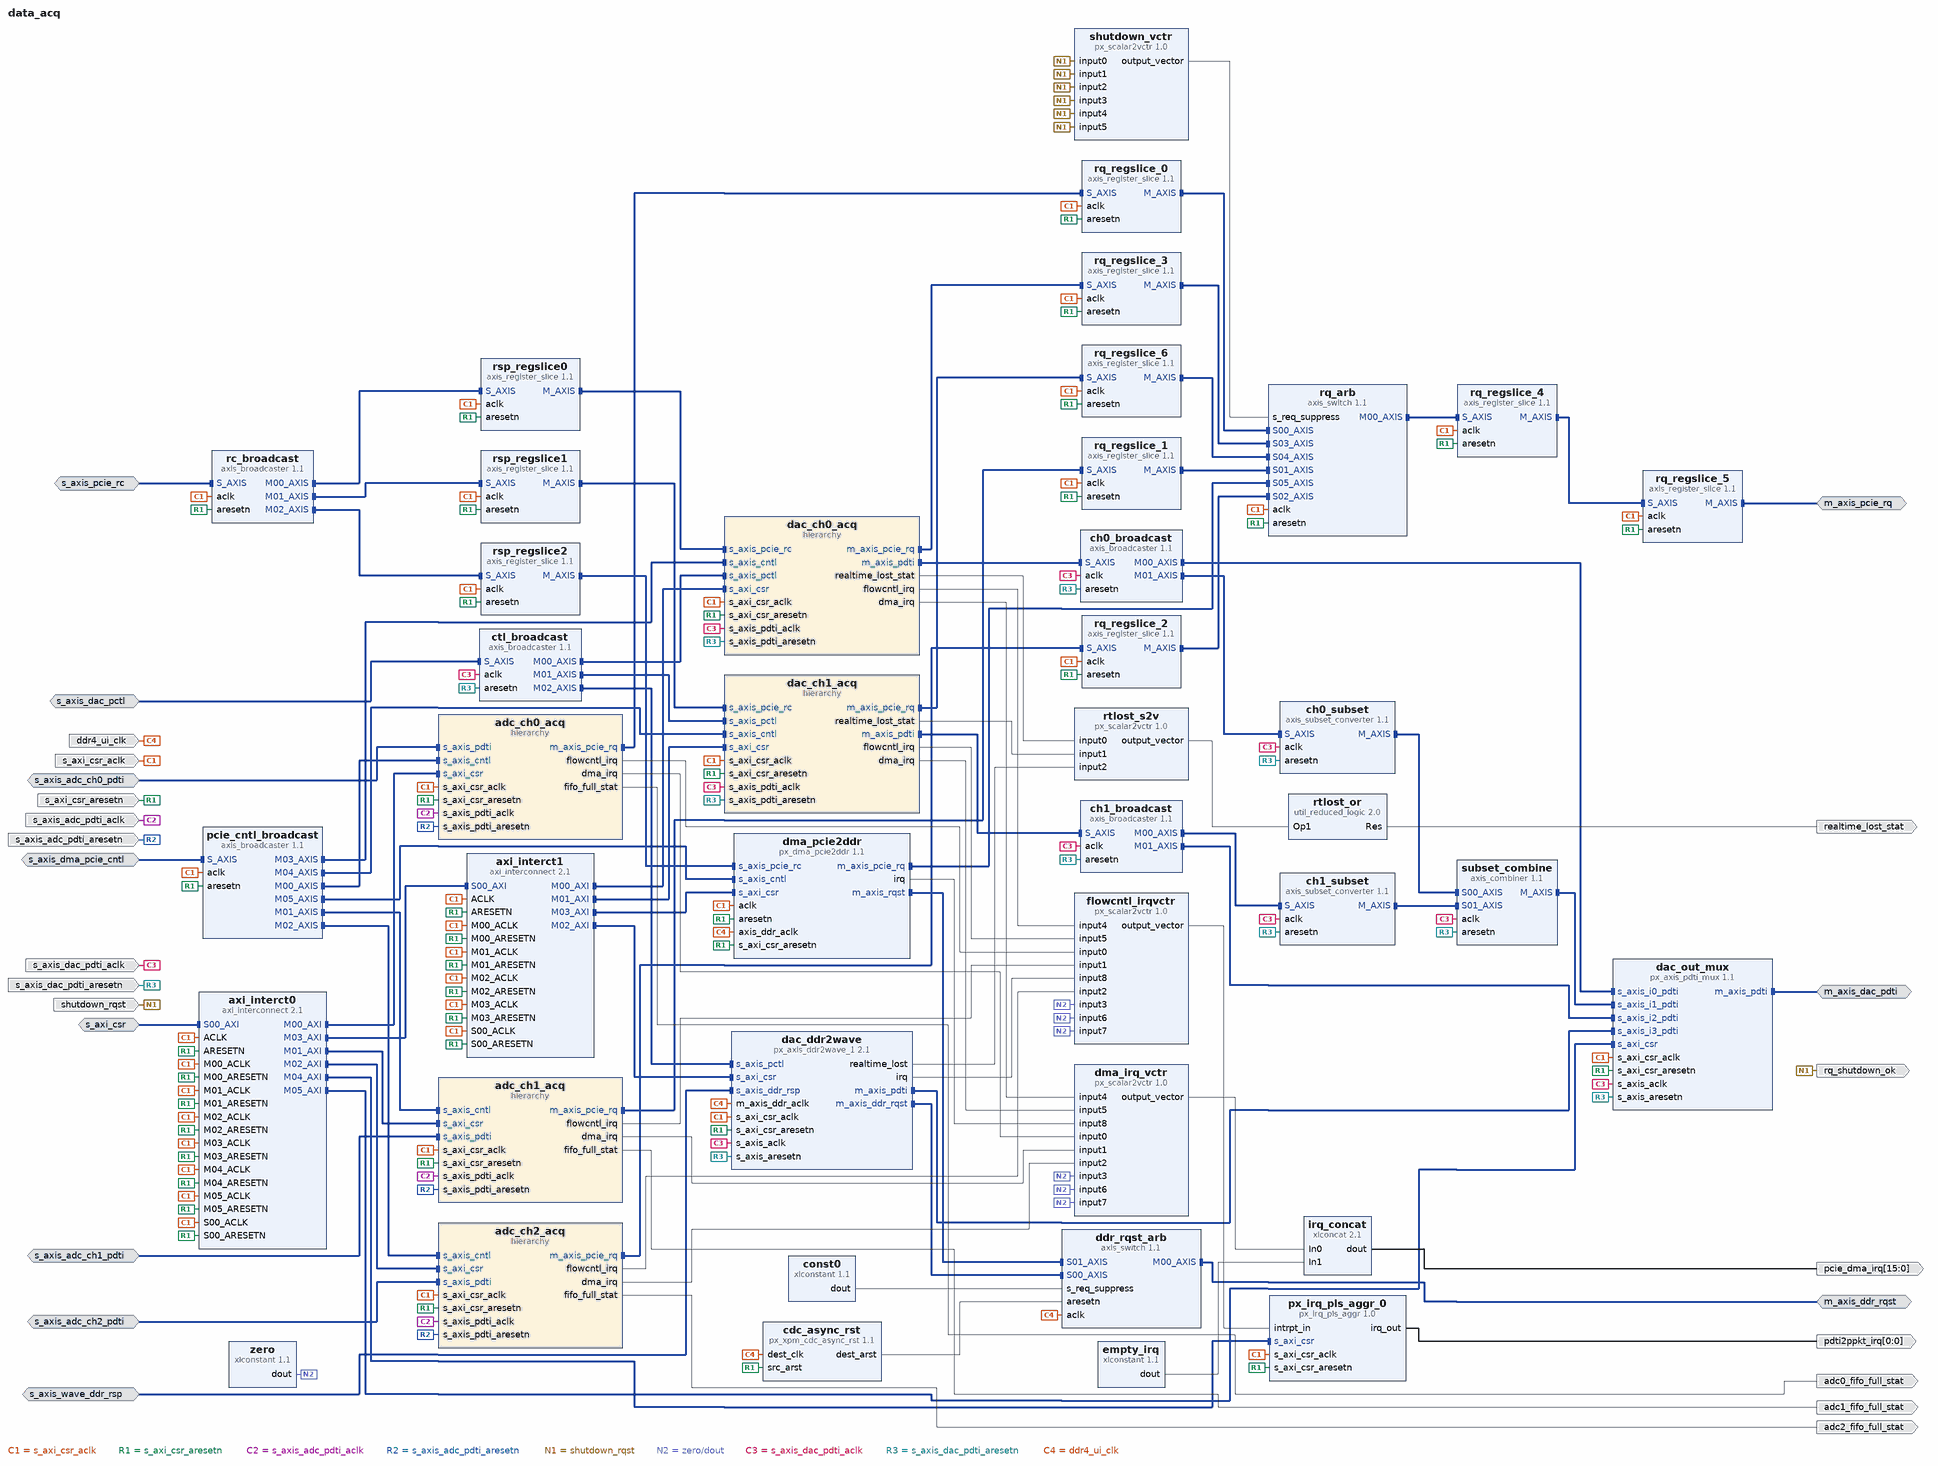
[diagram p0: block diagram of the top level]
# Vivado block design data_acq, xcku060-ffva1156-2-e, Vivado 2019.2
create_bd_design data_acq

create_bd_intf_port -mode Slave -vlnv xilinx.com:interface:aximm_rtl:1.0 s_axi_csr
set_property -dict [list \
  CONFIG.DATA_WIDTH 32 \
  CONFIG.PROTOCOL AXI4LITE \
  CONFIG.ID_WIDTH 0 \
  CONFIG.ADDR_WIDTH 26 \
  CONFIG.AWUSER_WIDTH 0 \
  CONFIG.ARUSER_WIDTH 0 \
  CONFIG.WUSER_WIDTH 0 \
  CONFIG.RUSER_WIDTH 0 \
  CONFIG.BUSER_WIDTH 0 \
  CONFIG.READ_WRITE_MODE READ_WRITE \
  CONFIG.HAS_BURST 1 \
  CONFIG.HAS_LOCK 1 \
  CONFIG.HAS_PROT 1 \
  CONFIG.HAS_CACHE 1 \
  CONFIG.HAS_QOS 1 \
  CONFIG.HAS_REGION 1 \
  CONFIG.HAS_WSTRB 1 \
  CONFIG.HAS_BRESP 1 \
  CONFIG.HAS_RRESP 1 \
  CONFIG.SUPPORTS_NARROW_BURST 0 \
  CONFIG.NUM_READ_OUTSTANDING 1 \
  CONFIG.NUM_WRITE_OUTSTANDING 1 \
  CONFIG.MAX_BURST_LENGTH 1 \
  CONFIG.NUM_READ_THREADS 1 \
  CONFIG.NUM_WRITE_THREADS 1 \
  CONFIG.RUSER_BITS_PER_BYTE 0 \
  CONFIG.WUSER_BITS_PER_BYTE 0 \
] [get_bd_intf_ports s_axi_csr]
create_bd_intf_port -mode Slave -vlnv xilinx.com:interface:axis_rtl:1.0 s_axis_adc_ch0_pdti
set_property -dict [list \
  CONFIG.TDATA_NUM_BYTES 4 \
  CONFIG.TDEST_WIDTH 0 \
  CONFIG.TID_WIDTH 0 \
  CONFIG.TUSER_WIDTH 128 \
  CONFIG.HAS_TREADY 0 \
  CONFIG.HAS_TSTRB 0 \
  CONFIG.HAS_TKEEP 0 \
  CONFIG.HAS_TLAST 0 \
  CONFIG.LAYERED_METADATA undef \
] [get_bd_intf_ports s_axis_adc_ch0_pdti]
create_bd_intf_port -mode Slave -vlnv xilinx.com:interface:axis_rtl:1.0 s_axis_adc_ch1_pdti
set_property -dict [list \
  CONFIG.TDATA_NUM_BYTES 4 \
  CONFIG.TDEST_WIDTH 0 \
  CONFIG.TID_WIDTH 0 \
  CONFIG.TUSER_WIDTH 128 \
  CONFIG.HAS_TREADY 0 \
  CONFIG.HAS_TSTRB 0 \
  CONFIG.HAS_TKEEP 0 \
  CONFIG.HAS_TLAST 0 \
  CONFIG.LAYERED_METADATA undef \
] [get_bd_intf_ports s_axis_adc_ch1_pdti]
create_bd_intf_port -mode Slave -vlnv xilinx.com:interface:axis_rtl:1.0 s_axis_adc_ch2_pdti
set_property -dict [list \
  CONFIG.TDATA_NUM_BYTES 4 \
  CONFIG.TDEST_WIDTH 0 \
  CONFIG.TID_WIDTH 0 \
  CONFIG.TUSER_WIDTH 128 \
  CONFIG.HAS_TREADY 0 \
  CONFIG.HAS_TSTRB 0 \
  CONFIG.HAS_TKEEP 0 \
  CONFIG.HAS_TLAST 0 \
  CONFIG.LAYERED_METADATA undef \
] [get_bd_intf_ports s_axis_adc_ch2_pdti]
create_bd_intf_port -mode Slave -vlnv xilinx.com:interface:axis_rtl:1.0 s_axis_dac_pctl
set_property -dict [list \
  CONFIG.TDATA_NUM_BYTES 1 \
  CONFIG.TDEST_WIDTH 0 \
  CONFIG.TID_WIDTH 0 \
  CONFIG.TUSER_WIDTH 0 \
  CONFIG.HAS_TREADY 0 \
  CONFIG.HAS_TSTRB 0 \
  CONFIG.HAS_TKEEP 0 \
  CONFIG.HAS_TLAST 0 \
  CONFIG.LAYERED_METADATA undef \
] [get_bd_intf_ports s_axis_dac_pctl]
create_bd_intf_port -mode Slave -vlnv xilinx.com:interface:axis_rtl:1.0 s_axis_dma_pcie_cntl
set_property -dict [list \
  CONFIG.TDATA_NUM_BYTES 1 \
  CONFIG.TDEST_WIDTH 0 \
  CONFIG.TID_WIDTH 0 \
  CONFIG.TUSER_WIDTH 0 \
  CONFIG.HAS_TREADY 1 \
  CONFIG.HAS_TSTRB 0 \
  CONFIG.HAS_TKEEP 0 \
  CONFIG.HAS_TLAST 0 \
  CONFIG.LAYERED_METADATA undef \
] [get_bd_intf_ports s_axis_dma_pcie_cntl]
create_bd_intf_port -mode Master -vlnv xilinx.com:interface:axis_rtl:1.0 m_axis_pcie_rq
set_property -dict {CONFIG.FREQ_HZ 250000000} [get_bd_intf_ports m_axis_pcie_rq]
create_bd_intf_port -mode Slave -vlnv xilinx.com:interface:axis_rtl:1.0 s_axis_pcie_rc
set_property -dict [list \
  CONFIG.TDATA_NUM_BYTES 32 \
  CONFIG.TDEST_WIDTH 0 \
  CONFIG.TID_WIDTH 0 \
  CONFIG.TUSER_WIDTH 75 \
  CONFIG.HAS_TREADY 1 \
  CONFIG.HAS_TSTRB 0 \
  CONFIG.HAS_TKEEP 1 \
  CONFIG.HAS_TLAST 1 \
  CONFIG.LAYERED_METADATA undef \
] [get_bd_intf_ports s_axis_pcie_rc]
create_bd_intf_port -mode Master -vlnv xilinx.com:interface:axis_rtl:1.0 m_axis_ddr_rqst
set_property -dict {CONFIG.FREQ_HZ 300000000} [get_bd_intf_ports m_axis_ddr_rqst]
create_bd_intf_port -mode Slave -vlnv xilinx.com:interface:axis_rtl:1.0 s_axis_wave_ddr_rsp
set_property -dict [list \
  CONFIG.TDATA_NUM_BYTES 64 \
  CONFIG.TDEST_WIDTH 0 \
  CONFIG.TID_WIDTH 8 \
  CONFIG.TUSER_WIDTH 256 \
  CONFIG.HAS_TREADY 0 \
  CONFIG.HAS_TSTRB 0 \
  CONFIG.HAS_TKEEP 0 \
  CONFIG.HAS_TLAST 1 \
  CONFIG.LAYERED_METADATA undef \
] [get_bd_intf_ports s_axis_wave_ddr_rsp]
create_bd_intf_port -mode Master -vlnv xilinx.com:interface:axis_rtl:1.0 m_axis_dac_pdti
set_property -dict {CONFIG.FREQ_HZ 250000000 CONFIG.CLK_DOMAIN data_acq_s_axis_dac_pdti_aclk} [get_bd_intf_ports m_axis_dac_pdti]
create_bd_port -dir I -type clk s_axi_csr_aclk
set_property -dict [list \
  CONFIG.ASSOCIATED_BUSIF s_axi_csr:s_axis_dma_pcie_cntl:m_axis_pcie_rq:s_axis_pcie_rc \
  CONFIG.FREQ_HZ 250000000 \
] [get_bd_ports s_axi_csr_aclk]
create_bd_port -dir I -type rst s_axi_csr_aresetn
create_bd_port -dir I -type clk s_axis_adc_pdti_aclk
set_property -dict [list \
  CONFIG.ASSOCIATED_BUSIF s_axis_adc_ch0_pdti:s_axis_adc_ch1_pdti:s_axis_adc_ch2_pdti \
  CONFIG.ASSOCIATED_RESET s_axis_adc_pdti_aresetn \
  CONFIG.FREQ_HZ 200000000 \
] [get_bd_ports s_axis_adc_pdti_aclk]
create_bd_port -dir I -type rst s_axis_adc_pdti_aresetn
create_bd_port -dir I shutdown_rqst
create_bd_port -dir O rq_shutdown_ok
create_bd_port -dir O -from 15 -to 0 pcie_dma_irq
create_bd_port -dir O adc0_fifo_full_stat
create_bd_port -dir O -from 0 -to 0 pdti2ppkt_irq
create_bd_port -dir O realtime_lost_stat
create_bd_port -dir I -type clk s_axis_dac_pdti_aclk
set_property -dict [list \
  CONFIG.ASSOCIATED_BUSIF s_axis_dac_pctl:m_axis_dac_pdti:s_axis_dac_pctl \
  CONFIG.ASSOCIATED_RESET s_axis_dac_pdti_aresetn \
  CONFIG.CLK_DOMAIN data_acq_s_axis_dac_pdti_aclk \
  CONFIG.FREQ_HZ 250000000 \
] [get_bd_ports s_axis_dac_pdti_aclk]
create_bd_port -dir I -type rst s_axis_dac_pdti_aresetn
create_bd_port -dir O adc1_fifo_full_stat
create_bd_port -dir O adc2_fifo_full_stat
create_bd_port -dir I -type clk ddr4_ui_clk
set_property -dict {CONFIG.ASSOCIATED_RESET s_axi_csr_aresetn CONFIG.FREQ_HZ 300000000} [get_bd_ports ddr4_ui_clk]

create_bd_cell -type hier adc_ch0_acq
create_bd_cell -type hier dac_ch1_acq
create_bd_cell -type hier dac_ch0_acq
create_bd_cell -type hier adc_ch1_acq
create_bd_cell -type hier adc_ch2_acq
create_bd_cell -type ip -vlnv xilinx.com:ip:util_reduced_logic:2.0 rtlost_or
set_property -dict {CONFIG.C_OPERATION or CONFIG.C_SIZE 3} [get_bd_cells rtlost_or]
create_bd_cell -type ip -vlnv xilinx.com:ip:xlconcat:2.1 irq_concat
set_property -dict {CONFIG.IN0_WIDTH 9 CONFIG.IN1_WIDTH 7 CONFIG.dout_width 16} [get_bd_cells irq_concat]
create_bd_cell -type ip -vlnv xilinx.com:ip:axi_interconnect:2.1 axi_interct0
set_property -dict [list \
  CONFIG.M00_HAS_REGSLICE 3 \
  CONFIG.M01_HAS_REGSLICE 3 \
  CONFIG.M02_HAS_REGSLICE 3 \
  CONFIG.M03_HAS_REGSLICE 3 \
  CONFIG.M04_HAS_REGSLICE 3 \
  CONFIG.M05_HAS_REGSLICE 3 \
  CONFIG.M06_HAS_REGSLICE 3 \
  CONFIG.M07_HAS_REGSLICE 3 \
  CONFIG.NUM_MI 6 \
  CONFIG.S00_HAS_REGSLICE 1 \
  CONFIG.SYNCHRONIZATION_STAGES 2 \
] [get_bd_cells axi_interct0]
create_bd_cell -type ip -vlnv xilinx.com:ip:axi_interconnect:2.1 axi_interct1
set_property -dict [list \
  CONFIG.M00_HAS_REGSLICE 3 \
  CONFIG.M01_HAS_REGSLICE 3 \
  CONFIG.M02_HAS_REGSLICE 3 \
  CONFIG.M03_HAS_REGSLICE 3 \
  CONFIG.M04_HAS_REGSLICE 3 \
  CONFIG.M05_HAS_REGSLICE 3 \
  CONFIG.M06_HAS_REGSLICE 3 \
  CONFIG.M07_HAS_REGSLICE 3 \
  CONFIG.NUM_MI 4 \
  CONFIG.S00_HAS_REGSLICE 1 \
  CONFIG.SYNCHRONIZATION_STAGES 2 \
] [get_bd_cells axi_interct1]
create_bd_cell -type ip -vlnv xilinx.com:ip:axis_broadcaster:1.1 pcie_cntl_broadcast
set_property -dict [list \
  CONFIG.HAS_TREADY 0 \
  CONFIG.M02_TDATA_REMAP {tdata[7:0]} \
  CONFIG.M03_TDATA_REMAP {tdata[7:0]} \
  CONFIG.M04_TDATA_REMAP {tdata[7:0]} \
  CONFIG.M05_TDATA_REMAP {tdata[7:0]} \
  CONFIG.NUM_MI 6 \
] [get_bd_cells pcie_cntl_broadcast]
create_bd_cell -type ip -vlnv xilinx.com:ip:axis_broadcaster:1.1 ctl_broadcast
set_property -dict {CONFIG.HAS_TREADY 0 CONFIG.M02_TDATA_REMAP {tdata[7:0]} CONFIG.NUM_MI 3} [get_bd_cells ctl_broadcast]
create_bd_cell -type ip -vlnv xilinx.com:ip:axis_broadcaster:1.1 ch0_broadcast
set_property -dict [list \
  CONFIG.M00_TDATA_REMAP {tdata[31:0]} \
  CONFIG.M00_TUSER_REMAP {tuser[127:0]} \
  CONFIG.M01_TDATA_REMAP {tdata[31:0]} \
  CONFIG.M01_TUSER_REMAP {tuser[127:0]} \
] [get_bd_cells ch0_broadcast]
create_bd_cell -type ip -vlnv xilinx.com:ip:axis_combiner:1.1 subset_combine
create_bd_cell -type ip -vlnv xilinx.com:ip:axis_register_slice:1.1 rq_regslice_0
create_bd_cell -type ip -vlnv xilinx.com:ip:axis_subset_converter:1.1 ch0_subset
set_property -dict [list \
  CONFIG.M_TDATA_NUM_BYTES 2 \
  CONFIG.M_TUSER_WIDTH 64 \
  CONFIG.S_TDATA_NUM_BYTES 4 \
  CONFIG.S_TUSER_WIDTH 128 \
  CONFIG.TDATA_REMAP {tdata[15:0]} \
  CONFIG.TUSER_REMAP {tuser[63:0]} \
] [get_bd_cells ch0_subset]
create_bd_cell -type ip -vlnv xilinx.com:ip:axis_subset_converter:1.1 ch1_subset
set_property -dict [list \
  CONFIG.M_TDATA_NUM_BYTES 2 \
  CONFIG.M_TUSER_WIDTH 64 \
  CONFIG.S_TDATA_NUM_BYTES 4 \
  CONFIG.S_TUSER_WIDTH 128 \
  CONFIG.TDATA_REMAP {tdata[15:0]} \
  CONFIG.TUSER_REMAP {tuser[127:64]} \
] [get_bd_cells ch1_subset]
create_bd_cell -type ip -vlnv xilinx.com:ip:axis_switch:1.1 rq_arb
set_property -dict [list \
  CONFIG.ARB_ALGORITHM 3 \
  CONFIG.ARB_ON_MAX_XFERS 0 \
  CONFIG.ARB_ON_TLAST 1 \
  CONFIG.HAS_TKEEP 1 \
  CONFIG.HAS_TLAST 1 \
  CONFIG.NUM_SI 6 \
  CONFIG.TDATA_NUM_BYTES 32 \
  CONFIG.TUSER_WIDTH 60 \
] [get_bd_cells rq_arb]
create_bd_cell -type ip -vlnv xilinx.com:ip:axis_broadcaster:1.1 ch1_broadcast
set_property -dict [list \
  CONFIG.M00_TDATA_REMAP {tdata[31:0]} \
  CONFIG.M00_TUSER_REMAP {tuser[127:0]} \
  CONFIG.M01_TDATA_REMAP {tdata[31:0]} \
  CONFIG.M01_TUSER_REMAP {tuser[127:0]} \
] [get_bd_cells ch1_broadcast]
create_bd_cell -type ip -vlnv xilinx.com:ip:axis_broadcaster:1.1 rc_broadcast
set_property -dict [list \
  CONFIG.M00_TDATA_REMAP {tdata[255:0]} \
  CONFIG.M00_TUSER_REMAP {tuser[74:0]} \
  CONFIG.M01_TDATA_REMAP {tdata[255:0]} \
  CONFIG.M01_TUSER_REMAP {tuser[74:0]} \
  CONFIG.M02_TDATA_REMAP {tdata[255:0]} \
  CONFIG.M02_TUSER_REMAP {tuser[74:0]} \
  CONFIG.NUM_MI 3 \
] [get_bd_cells rc_broadcast]
create_bd_cell -type ip -vlnv pentek.com:px_ip:px_axis_ddr2wave_1:2.1 dac_ddr2wave
set_property -dict {CONFIG.ddr4_requestor_id 1} [get_bd_cells dac_ddr2wave]
create_bd_cell -type ip -vlnv pentek.com:px_ip:px_axis_pdti_mux:1.1 dac_out_mux
set_property -dict {CONFIG.data_byte_width 4 CONFIG.num_input_streams 4} [get_bd_cells dac_out_mux]
create_bd_cell -type ip -vlnv pentek.com:px_ip:px_dma_pcie2ddr:1.1 dma_pcie2ddr
set_property -dict {CONFIG.pcie_channel 6} [get_bd_cells dma_pcie2ddr]
create_bd_cell -type ip -vlnv pentek.com:px_ip:px_irq_pls_aggr:1.0 px_irq_pls_aggr_0
set_property -dict {CONFIG.num_interrupt_sources 9} [get_bd_cells px_irq_pls_aggr_0]
create_bd_cell -type ip -vlnv pentek.com:px_ip:px_scalar2vctr:1.0 shutdown_vctr
set_property -dict {CONFIG.number_inputs 6} [get_bd_cells shutdown_vctr]
create_bd_cell -type ip -vlnv pentek.com:px_ip:px_scalar2vctr:1.0 flowcntl_irqvctr
set_property -dict {CONFIG.number_inputs 9} [get_bd_cells flowcntl_irqvctr]
create_bd_cell -type ip -vlnv pentek.com:px_ip:px_scalar2vctr:1.0 rtlost_s2v
set_property -dict {CONFIG.number_inputs 3} [get_bd_cells rtlost_s2v]
create_bd_cell -type ip -vlnv pentek.com:px_ip:px_scalar2vctr:1.0 dma_irq_vctr
set_property -dict {CONFIG.number_inputs 9} [get_bd_cells dma_irq_vctr]
create_bd_cell -type ip -vlnv pentek.com:px_ip:px_xpm_cdc_async_rst:1.1 cdc_async_rst
set_property -dict {CONFIG.DEST_SYNC_FF 3} [get_bd_cells cdc_async_rst]
create_bd_cell -type ip -vlnv xilinx.com:ip:axis_switch:1.1 ddr_rqst_arb
set_property -dict [list \
  CONFIG.ARB_ALGORITHM 3 \
  CONFIG.ARB_ON_MAX_XFERS 0 \
  CONFIG.ARB_ON_TLAST 1 \
  CONFIG.HAS_TLAST 1 \
  CONFIG.NUM_SI 2 \
  CONFIG.TDATA_NUM_BYTES 64 \
  CONFIG.TUSER_WIDTH 256 \
] [get_bd_cells ddr_rqst_arb]
create_bd_cell -type ip -vlnv xilinx.com:ip:axis_register_slice:1.1 rq_regslice_1
create_bd_cell -type ip -vlnv xilinx.com:ip:axis_register_slice:1.1 rq_regslice_4
create_bd_cell -type ip -vlnv xilinx.com:ip:axis_register_slice:1.1 rq_regslice_2
create_bd_cell -type ip -vlnv xilinx.com:ip:axis_register_slice:1.1 rq_regslice_3
create_bd_cell -type ip -vlnv xilinx.com:ip:axis_register_slice:1.1 rsp_regslice0
create_bd_cell -type ip -vlnv xilinx.com:ip:axis_register_slice:1.1 rq_regslice_6
create_bd_cell -type ip -vlnv xilinx.com:ip:axis_register_slice:1.1 rq_regslice_5
create_bd_cell -type ip -vlnv xilinx.com:ip:axis_register_slice:1.1 rsp_regslice1
create_bd_cell -type ip -vlnv xilinx.com:ip:axis_register_slice:1.1 rsp_regslice2
create_bd_cell -type ip -vlnv xilinx.com:ip:xlconstant:1.1 empty_irq
set_property -dict {CONFIG.CONST_VAL 0 CONFIG.CONST_WIDTH 7} [get_bd_cells empty_irq]
create_bd_cell -type ip -vlnv xilinx.com:ip:xlconstant:1.1 zero
set_property -dict {CONFIG.CONST_VAL 0} [get_bd_cells zero]
create_bd_cell -type ip -vlnv xilinx.com:ip:xlconstant:1.1 const0
set_property -dict {CONFIG.CONST_VAL 0 CONFIG.CONST_WIDTH 2} [get_bd_cells const0]

# ---- hierarchy /adc_ch0_acq ----
current_bd_instance /adc_ch0_acq
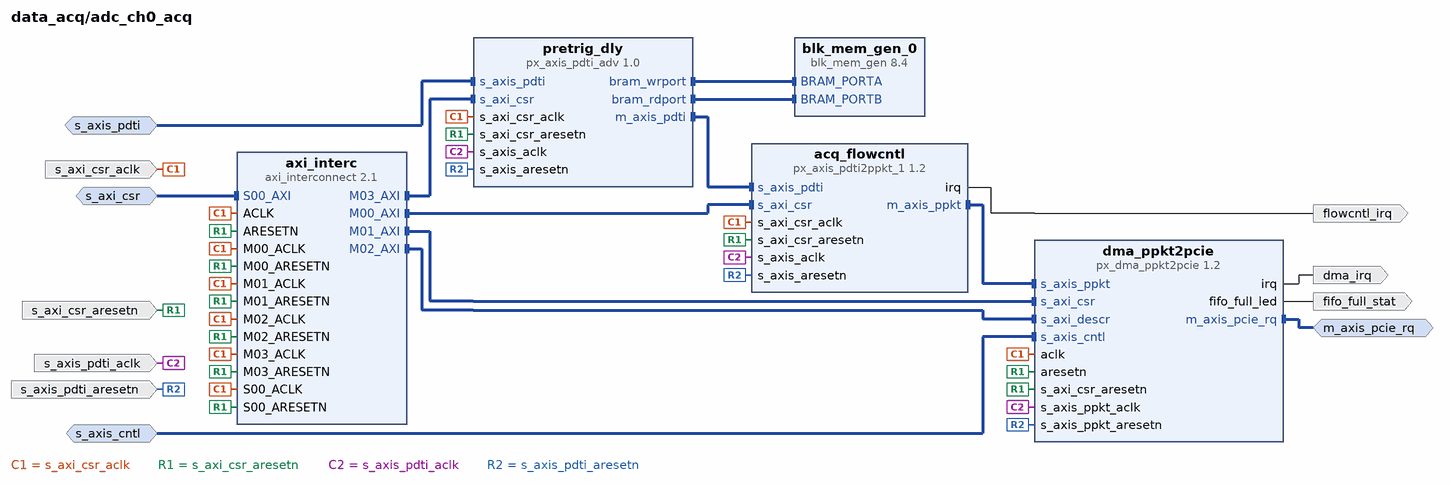
[diagram p1: block diagram inside /adc_ch0_acq]
create_bd_intf_pin -mode Slave -vlnv xilinx.com:interface:aximm_rtl:1.0 s_axi_csr
create_bd_intf_pin -mode Slave -vlnv xilinx.com:interface:axis_rtl:1.0 s_axis_pdti
create_bd_intf_pin -mode Master -vlnv xilinx.com:interface:axis_rtl:1.0 m_axis_pcie_rq
create_bd_intf_pin -mode Slave -vlnv xilinx.com:interface:axis_rtl:1.0 s_axis_cntl
create_bd_pin -dir I s_axi_csr_aclk
create_bd_pin -dir I s_axi_csr_aresetn
create_bd_pin -dir O flowcntl_irq
create_bd_pin -dir O dma_irq
create_bd_pin -dir O fifo_full_stat
create_bd_pin -dir I s_axis_pdti_aclk
create_bd_pin -dir I s_axis_pdti_aresetn

create_bd_cell -type ip -vlnv xilinx.com:ip:axi_interconnect:2.1 axi_interc
set_property -dict [list \
  CONFIG.M00_HAS_REGSLICE 3 \
  CONFIG.M01_HAS_REGSLICE 3 \
  CONFIG.M02_HAS_REGSLICE 3 \
  CONFIG.NUM_MI 4 \
  CONFIG.S00_HAS_REGSLICE 1 \
  CONFIG.SYNCHRONIZATION_STAGES 2 \
] [get_bd_cells axi_interc]
create_bd_cell -type ip -vlnv xilinx.com:ip:blk_mem_gen:8.4 blk_mem_gen_0
set_property -dict [list \
  CONFIG.Assume_Synchronous_Clk true \
  CONFIG.Byte_Size 8 \
  CONFIG.Enable_32bit_Address false \
  CONFIG.Enable_B Use_ENB_Pin \
  CONFIG.Memory_Type Simple_Dual_Port_RAM \
  CONFIG.Operating_Mode_A NO_CHANGE \
  CONFIG.Port_B_Clock 100 \
  CONFIG.Port_B_Enable_Rate 100 \
  CONFIG.Read_Width_B 160 \
  CONFIG.Register_PortB_Output_of_Memory_Primitives true \
  CONFIG.Use_Byte_Write_Enable true \
  CONFIG.Write_Depth_A 1024 \
  CONFIG.Write_Width_A 160 \
  CONFIG.Write_Width_B 160 \
  CONFIG.use_bram_block Stand_Alone \
] [get_bd_cells blk_mem_gen_0]
create_bd_cell -type ip -vlnv pentek.com:px_ip:px_axis_pdti2ppkt_1:1.2 acq_flowcntl
create_bd_cell -type ip -vlnv pentek.com:user:px_axis_pdti_adv:1.0 pretrig_dly
set_property -dict {CONFIG.data_byte_width 4 CONFIG.delay_ctl_width 10} [get_bd_cells pretrig_dly]
create_bd_cell -type ip -vlnv pentek.com:px_ip:px_dma_ppkt2pcie:1.2 dma_ppkt2pcie
set_property -dict {CONFIG.fifo_size 2 CONFIG.input_word_width 2 CONFIG.lite false} [get_bd_cells dma_ppkt2pcie]

# ---- hierarchy /dac_ch1_acq ----
current_bd_instance /dac_ch1_acq
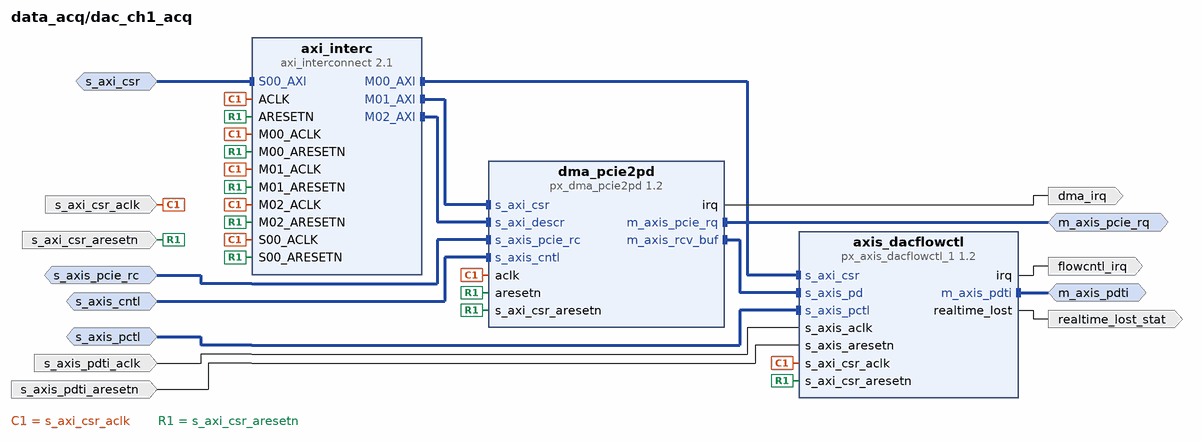
[diagram p2: block diagram inside /dac_ch1_acq]
create_bd_intf_pin -mode Slave -vlnv xilinx.com:interface:aximm_rtl:1.0 s_axi_csr
create_bd_intf_pin -mode Slave -vlnv xilinx.com:interface:axis_rtl:1.0 s_axis_pctl
create_bd_intf_pin -mode Master -vlnv xilinx.com:interface:axis_rtl:1.0 m_axis_pcie_rq
create_bd_intf_pin -mode Slave -vlnv xilinx.com:interface:axis_rtl:1.0 s_axis_cntl
create_bd_intf_pin -mode Slave -vlnv xilinx.com:interface:axis_rtl:1.0 s_axis_pcie_rc
create_bd_intf_pin -mode Master -vlnv xilinx.com:interface:axis_rtl:1.0 m_axis_pdti
create_bd_pin -dir I s_axi_csr_aclk
create_bd_pin -dir I s_axi_csr_aresetn
create_bd_pin -dir O flowcntl_irq
create_bd_pin -dir O dma_irq
create_bd_pin -dir O realtime_lost_stat
create_bd_pin -dir I s_axis_pdti_aclk
create_bd_pin -dir I s_axis_pdti_aresetn

create_bd_cell -type ip -vlnv xilinx.com:ip:axi_interconnect:2.1 axi_interc
set_property -dict [list \
  CONFIG.M00_HAS_REGSLICE 3 \
  CONFIG.M01_HAS_REGSLICE 3 \
  CONFIG.M02_HAS_REGSLICE 3 \
  CONFIG.NUM_MI 3 \
  CONFIG.S00_HAS_REGSLICE 1 \
  CONFIG.SYNCHRONIZATION_STAGES 2 \
] [get_bd_cells axi_interc]
create_bd_cell -type ip -vlnv xilinx.com:px_ip:px_axis_dacflowctl_1:1.2 axis_dacflowctl
create_bd_cell -type ip -vlnv pentek.com:px_ip:px_dma_pcie2pd:1.2 dma_pcie2pd
set_property -dict {CONFIG.pcie_channel 5} [get_bd_cells dma_pcie2pd]

# ---- hierarchy /dac_ch0_acq ----
current_bd_instance /dac_ch0_acq
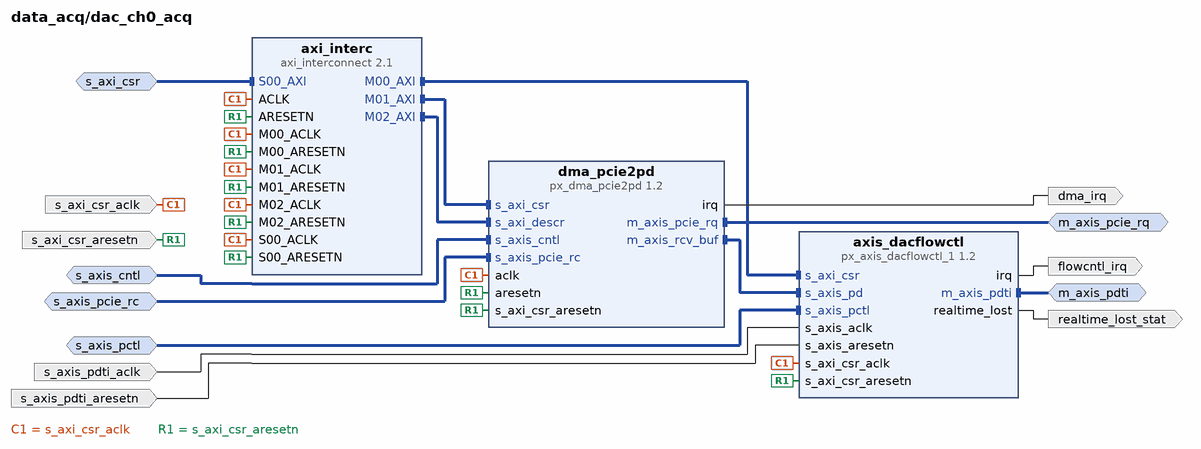
[diagram p3: block diagram inside /dac_ch0_acq]
create_bd_intf_pin -mode Slave -vlnv xilinx.com:interface:aximm_rtl:1.0 s_axi_csr
create_bd_intf_pin -mode Slave -vlnv xilinx.com:interface:axis_rtl:1.0 s_axis_pctl
create_bd_intf_pin -mode Master -vlnv xilinx.com:interface:axis_rtl:1.0 m_axis_pcie_rq
create_bd_intf_pin -mode Slave -vlnv xilinx.com:interface:axis_rtl:1.0 s_axis_cntl
create_bd_intf_pin -mode Slave -vlnv xilinx.com:interface:axis_rtl:1.0 s_axis_pcie_rc
create_bd_intf_pin -mode Master -vlnv xilinx.com:interface:axis_rtl:1.0 m_axis_pdti
create_bd_pin -dir I s_axi_csr_aclk
create_bd_pin -dir I s_axi_csr_aresetn
create_bd_pin -dir O flowcntl_irq
create_bd_pin -dir O dma_irq
create_bd_pin -dir O realtime_lost_stat
create_bd_pin -dir I s_axis_pdti_aclk
create_bd_pin -dir I s_axis_pdti_aresetn

create_bd_cell -type ip -vlnv xilinx.com:ip:axi_interconnect:2.1 axi_interc
set_property -dict [list \
  CONFIG.M00_HAS_REGSLICE 3 \
  CONFIG.M01_HAS_REGSLICE 3 \
  CONFIG.M02_HAS_REGSLICE 3 \
  CONFIG.NUM_MI 3 \
  CONFIG.S00_HAS_REGSLICE 1 \
  CONFIG.SYNCHRONIZATION_STAGES 2 \
] [get_bd_cells axi_interc]
create_bd_cell -type ip -vlnv xilinx.com:px_ip:px_axis_dacflowctl_1:1.2 axis_dacflowctl
create_bd_cell -type ip -vlnv pentek.com:px_ip:px_dma_pcie2pd:1.2 dma_pcie2pd
set_property -dict {CONFIG.pcie_channel 4} [get_bd_cells dma_pcie2pd]

# ---- hierarchy /adc_ch1_acq ----
current_bd_instance /adc_ch1_acq
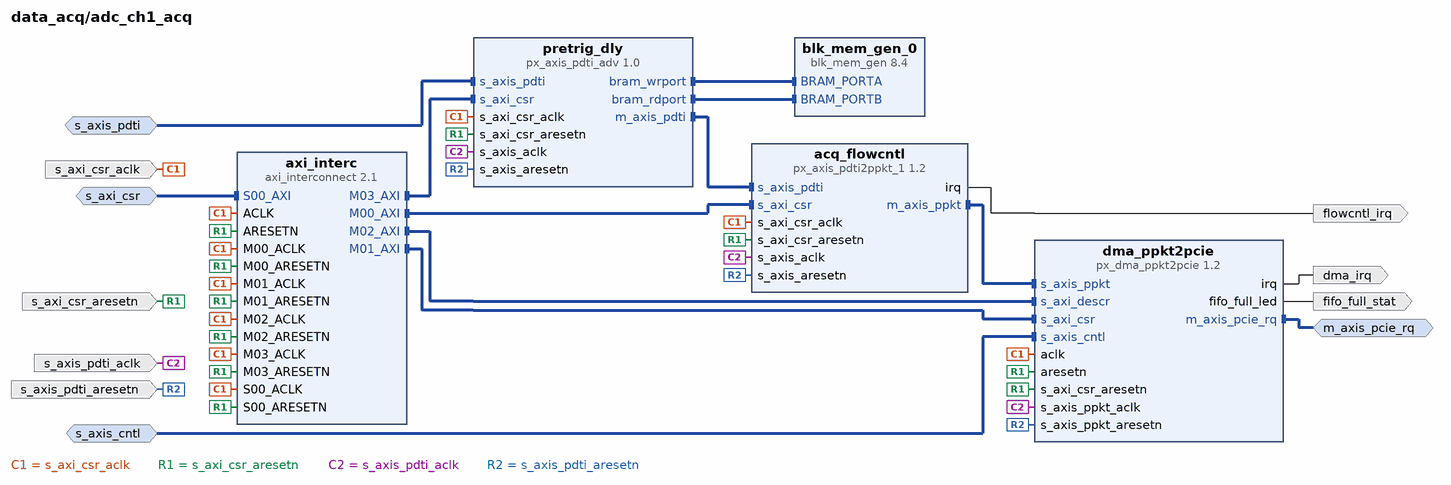
[diagram p4: block diagram inside /adc_ch1_acq]
create_bd_intf_pin -mode Slave -vlnv xilinx.com:interface:aximm_rtl:1.0 s_axi_csr
create_bd_intf_pin -mode Slave -vlnv xilinx.com:interface:axis_rtl:1.0 s_axis_pdti
create_bd_intf_pin -mode Master -vlnv xilinx.com:interface:axis_rtl:1.0 m_axis_pcie_rq
create_bd_intf_pin -mode Slave -vlnv xilinx.com:interface:axis_rtl:1.0 s_axis_cntl
create_bd_pin -dir I s_axi_csr_aclk
create_bd_pin -dir I s_axi_csr_aresetn
create_bd_pin -dir O flowcntl_irq
create_bd_pin -dir O dma_irq
create_bd_pin -dir O fifo_full_stat
create_bd_pin -dir I s_axis_pdti_aclk
create_bd_pin -dir I s_axis_pdti_aresetn

create_bd_cell -type ip -vlnv pentek.com:px_ip:px_axis_pdti2ppkt_1:1.2 acq_flowcntl
create_bd_cell -type ip -vlnv xilinx.com:ip:axi_interconnect:2.1 axi_interc
set_property -dict [list \
  CONFIG.M00_HAS_REGSLICE 3 \
  CONFIG.M01_HAS_REGSLICE 3 \
  CONFIG.M02_HAS_REGSLICE 3 \
  CONFIG.NUM_MI 4 \
  CONFIG.S00_HAS_REGSLICE 1 \
  CONFIG.SYNCHRONIZATION_STAGES 2 \
] [get_bd_cells axi_interc]
create_bd_cell -type ip -vlnv xilinx.com:ip:blk_mem_gen:8.4 blk_mem_gen_0
set_property -dict [list \
  CONFIG.Assume_Synchronous_Clk true \
  CONFIG.Byte_Size 8 \
  CONFIG.Enable_32bit_Address false \
  CONFIG.Enable_B Use_ENB_Pin \
  CONFIG.Memory_Type Simple_Dual_Port_RAM \
  CONFIG.Operating_Mode_A NO_CHANGE \
  CONFIG.Port_B_Clock 100 \
  CONFIG.Port_B_Enable_Rate 100 \
  CONFIG.Read_Width_B 160 \
  CONFIG.Register_PortB_Output_of_Memory_Primitives true \
  CONFIG.Use_Byte_Write_Enable true \
  CONFIG.Write_Depth_A 1024 \
  CONFIG.Write_Width_A 160 \
  CONFIG.Write_Width_B 160 \
  CONFIG.use_bram_block Stand_Alone \
] [get_bd_cells blk_mem_gen_0]
create_bd_cell -type ip -vlnv pentek.com:px_ip:px_dma_ppkt2pcie:1.2 dma_ppkt2pcie
set_property -dict [list \
  CONFIG.fifo_size 2 \
  CONFIG.input_word_width 2 \
  CONFIG.lite false \
  CONFIG.pcie_channel 1 \
] [get_bd_cells dma_ppkt2pcie]
create_bd_cell -type ip -vlnv pentek.com:user:px_axis_pdti_adv:1.0 pretrig_dly
set_property -dict {CONFIG.data_byte_width 4 CONFIG.delay_ctl_width 10} [get_bd_cells pretrig_dly]

# ---- hierarchy /adc_ch2_acq ----
current_bd_instance /adc_ch2_acq
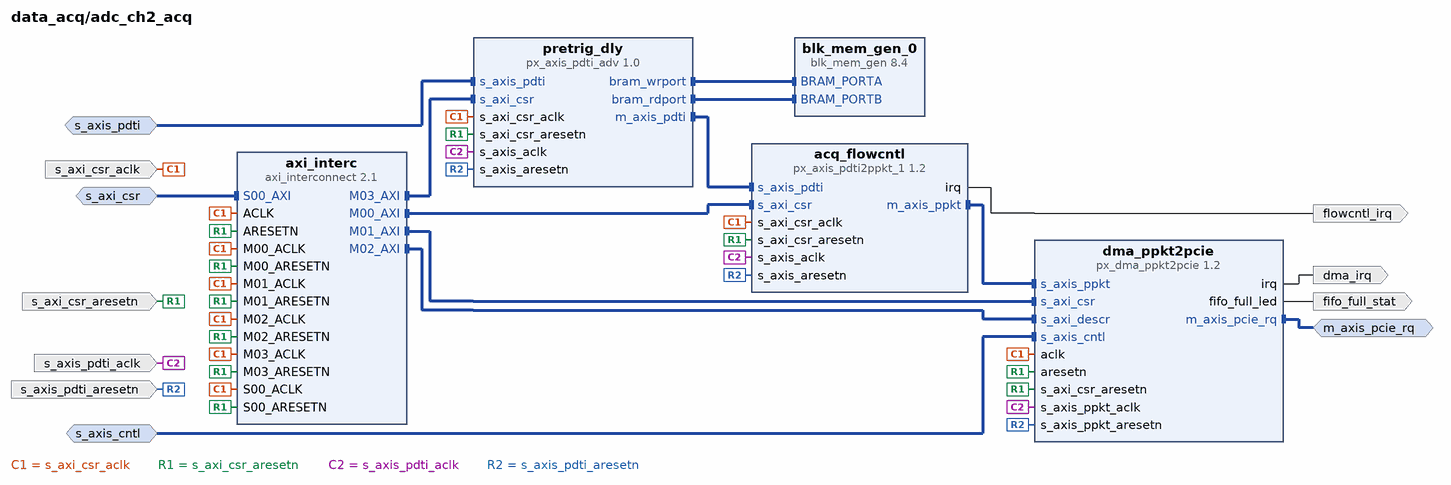
[diagram p5: block diagram inside /adc_ch2_acq]
create_bd_intf_pin -mode Slave -vlnv xilinx.com:interface:aximm_rtl:1.0 s_axi_csr
create_bd_intf_pin -mode Slave -vlnv xilinx.com:interface:axis_rtl:1.0 s_axis_pdti
create_bd_intf_pin -mode Master -vlnv xilinx.com:interface:axis_rtl:1.0 m_axis_pcie_rq
create_bd_intf_pin -mode Slave -vlnv xilinx.com:interface:axis_rtl:1.0 s_axis_cntl
create_bd_pin -dir I s_axi_csr_aclk
create_bd_pin -dir I s_axi_csr_aresetn
create_bd_pin -dir O flowcntl_irq
create_bd_pin -dir O dma_irq
create_bd_pin -dir O fifo_full_stat
create_bd_pin -dir I s_axis_pdti_aclk
create_bd_pin -dir I s_axis_pdti_aresetn

create_bd_cell -type ip -vlnv pentek.com:px_ip:px_axis_pdti2ppkt_1:1.2 acq_flowcntl
create_bd_cell -type ip -vlnv xilinx.com:ip:axi_interconnect:2.1 axi_interc
set_property -dict [list \
  CONFIG.M00_HAS_REGSLICE 3 \
  CONFIG.M01_HAS_REGSLICE 3 \
  CONFIG.M02_HAS_REGSLICE 3 \
  CONFIG.NUM_MI 4 \
  CONFIG.S00_HAS_REGSLICE 1 \
  CONFIG.SYNCHRONIZATION_STAGES 2 \
] [get_bd_cells axi_interc]
create_bd_cell -type ip -vlnv xilinx.com:ip:blk_mem_gen:8.4 blk_mem_gen_0
set_property -dict [list \
  CONFIG.Assume_Synchronous_Clk true \
  CONFIG.Byte_Size 8 \
  CONFIG.Enable_32bit_Address false \
  CONFIG.Enable_B Use_ENB_Pin \
  CONFIG.Memory_Type Simple_Dual_Port_RAM \
  CONFIG.Operating_Mode_A NO_CHANGE \
  CONFIG.Port_B_Clock 100 \
  CONFIG.Port_B_Enable_Rate 100 \
  CONFIG.Read_Width_B 160 \
  CONFIG.Register_PortB_Output_of_Memory_Primitives true \
  CONFIG.Use_Byte_Write_Enable true \
  CONFIG.Write_Depth_A 1024 \
  CONFIG.Write_Width_A 160 \
  CONFIG.Write_Width_B 160 \
  CONFIG.use_bram_block Stand_Alone \
] [get_bd_cells blk_mem_gen_0]
create_bd_cell -type ip -vlnv pentek.com:px_ip:px_dma_ppkt2pcie:1.2 dma_ppkt2pcie
set_property -dict [list \
  CONFIG.fifo_size 2 \
  CONFIG.input_word_width 2 \
  CONFIG.lite false \
  CONFIG.pcie_channel 2 \
] [get_bd_cells dma_ppkt2pcie]
create_bd_cell -type ip -vlnv pentek.com:user:px_axis_pdti_adv:1.0 pretrig_dly
set_property -dict {CONFIG.data_byte_width 4 CONFIG.delay_ctl_width 10} [get_bd_cells pretrig_dly]

# ---- connections ----

current_bd_instance /adc_ch0_acq
connect_bd_intf_net [get_bd_intf_pins m_axis_pcie_rq] [get_bd_intf_pins dma_ppkt2pcie/m_axis_pcie_rq]
connect_bd_intf_net [get_bd_intf_pins pretrig_dly/s_axi_csr] [get_bd_intf_pins axi_interc/M03_AXI]
connect_bd_intf_net [get_bd_intf_pins s_axi_csr] [get_bd_intf_pins axi_interc/S00_AXI]
connect_bd_intf_net [get_bd_intf_pins axi_interc/M01_AXI] [get_bd_intf_pins dma_ppkt2pcie/s_axi_csr]
connect_bd_intf_net [get_bd_intf_pins dma_ppkt2pcie/s_axis_ppkt] [get_bd_intf_pins acq_flowcntl/m_axis_ppkt]
connect_bd_intf_net [get_bd_intf_pins axi_interc/M02_AXI] [get_bd_intf_pins dma_ppkt2pcie/s_axi_descr]
connect_bd_intf_net [get_bd_intf_pins s_axis_pdti] [get_bd_intf_pins pretrig_dly/s_axis_pdti]
connect_bd_intf_net [get_bd_intf_pins axi_interc/M00_AXI] [get_bd_intf_pins acq_flowcntl/s_axi_csr]
connect_bd_intf_net [get_bd_intf_pins blk_mem_gen_0/BRAM_PORTA] [get_bd_intf_pins pretrig_dly/bram_wrport]
connect_bd_intf_net [get_bd_intf_pins pretrig_dly/m_axis_pdti] [get_bd_intf_pins acq_flowcntl/s_axis_pdti]
connect_bd_intf_net [get_bd_intf_pins s_axis_cntl] [get_bd_intf_pins dma_ppkt2pcie/s_axis_cntl]
connect_bd_intf_net [get_bd_intf_pins pretrig_dly/bram_rdport] [get_bd_intf_pins blk_mem_gen_0/BRAM_PORTB]
connect_bd_net [get_bd_pins s_axi_csr_aclk] \
  [get_bd_pins axi_interc/ACLK] [get_bd_pins axi_interc/S00_ACLK] [get_bd_pins axi_interc/M00_ACLK] \
  [get_bd_pins axi_interc/M01_ACLK] [get_bd_pins axi_interc/M02_ACLK] [get_bd_pins axi_interc/M03_ACLK] \
  [get_bd_pins acq_flowcntl/s_axi_csr_aclk] [get_bd_pins pretrig_dly/s_axi_csr_aclk] [get_bd_pins dma_ppkt2pcie/aclk]
connect_bd_net [get_bd_pins s_axi_csr_aresetn] \
  [get_bd_pins axi_interc/ARESETN] [get_bd_pins axi_interc/S00_ARESETN] [get_bd_pins axi_interc/M00_ARESETN] \
  [get_bd_pins axi_interc/M01_ARESETN] [get_bd_pins axi_interc/M02_ARESETN] [get_bd_pins axi_interc/M03_ARESETN] \
  [get_bd_pins acq_flowcntl/s_axi_csr_aresetn] [get_bd_pins pretrig_dly/s_axi_csr_aresetn] \
  [get_bd_pins dma_ppkt2pcie/aresetn] [get_bd_pins dma_ppkt2pcie/s_axi_csr_aresetn]
connect_bd_net [get_bd_pins acq_flowcntl/irq] [get_bd_pins flowcntl_irq]
connect_bd_net [get_bd_pins dma_ppkt2pcie/irq] [get_bd_pins dma_irq]
connect_bd_net [get_bd_pins dma_ppkt2pcie/fifo_full_led] [get_bd_pins fifo_full_stat]
connect_bd_net [get_bd_pins s_axis_pdti_aclk] \
  [get_bd_pins acq_flowcntl/s_axis_aclk] [get_bd_pins pretrig_dly/s_axis_aclk] [get_bd_pins dma_ppkt2pcie/s_axis_ppkt_aclk]
connect_bd_net [get_bd_pins s_axis_pdti_aresetn] \
  [get_bd_pins acq_flowcntl/s_axis_aresetn] [get_bd_pins pretrig_dly/s_axis_aresetn] \
  [get_bd_pins dma_ppkt2pcie/s_axis_ppkt_aresetn]

current_bd_instance /dac_ch1_acq
connect_bd_intf_net [get_bd_intf_pins s_axis_pctl] [get_bd_intf_pins axis_dacflowctl/s_axis_pctl]
connect_bd_intf_net [get_bd_intf_pins dma_pcie2pd/s_axi_csr] [get_bd_intf_pins axi_interc/M01_AXI]
connect_bd_intf_net [get_bd_intf_pins axis_dacflowctl/s_axi_csr] [get_bd_intf_pins axi_interc/M00_AXI]
connect_bd_intf_net [get_bd_intf_pins axis_dacflowctl/s_axis_pd] [get_bd_intf_pins dma_pcie2pd/m_axis_rcv_buf]
connect_bd_intf_net [get_bd_intf_pins s_axis_pcie_rc] [get_bd_intf_pins dma_pcie2pd/s_axis_pcie_rc]
connect_bd_intf_net [get_bd_intf_pins m_axis_pcie_rq] [get_bd_intf_pins dma_pcie2pd/m_axis_pcie_rq]
connect_bd_intf_net [get_bd_intf_pins s_axi_csr] [get_bd_intf_pins axi_interc/S00_AXI]
connect_bd_intf_net [get_bd_intf_pins s_axis_cntl] [get_bd_intf_pins dma_pcie2pd/s_axis_cntl]
connect_bd_intf_net [get_bd_intf_pins dma_pcie2pd/s_axi_descr] [get_bd_intf_pins axi_interc/M02_AXI]
connect_bd_intf_net [get_bd_intf_pins m_axis_pdti] [get_bd_intf_pins axis_dacflowctl/m_axis_pdti]
connect_bd_net [get_bd_pins s_axi_csr_aclk] \
  [get_bd_pins axi_interc/ACLK] [get_bd_pins axi_interc/S00_ACLK] [get_bd_pins axi_interc/M00_ACLK] \
  [get_bd_pins axi_interc/M01_ACLK] [get_bd_pins axi_interc/M02_ACLK] [get_bd_pins axis_dacflowctl/s_axi_csr_aclk] \
  [get_bd_pins dma_pcie2pd/aclk]
connect_bd_net [get_bd_pins s_axi_csr_aresetn] \
  [get_bd_pins axi_interc/ARESETN] [get_bd_pins axi_interc/S00_ARESETN] [get_bd_pins axi_interc/M00_ARESETN] \
  [get_bd_pins axi_interc/M01_ARESETN] [get_bd_pins axi_interc/M02_ARESETN] [get_bd_pins axis_dacflowctl/s_axi_csr_aresetn] \
  [get_bd_pins dma_pcie2pd/aresetn] [get_bd_pins dma_pcie2pd/s_axi_csr_aresetn]
connect_bd_net [get_bd_pins s_axis_pdti_aclk] [get_bd_pins axis_dacflowctl/s_axis_aclk]
connect_bd_net [get_bd_pins s_axis_pdti_aresetn] [get_bd_pins axis_dacflowctl/s_axis_aresetn]
connect_bd_net -net px_dma_pcie2pd_0_irq [get_bd_pins dma_pcie2pd/irq] [get_bd_pins dma_irq]
connect_bd_net [get_bd_pins axis_dacflowctl/irq] [get_bd_pins flowcntl_irq]
connect_bd_net [get_bd_pins axis_dacflowctl/realtime_lost] [get_bd_pins realtime_lost_stat]

current_bd_instance /dac_ch0_acq
connect_bd_intf_net [get_bd_intf_pins s_axis_cntl] [get_bd_intf_pins dma_pcie2pd/s_axis_cntl]
connect_bd_intf_net [get_bd_intf_pins m_axis_pdti] [get_bd_intf_pins axis_dacflowctl/m_axis_pdti]
connect_bd_intf_net [get_bd_intf_pins axis_dacflowctl/s_axi_csr] [get_bd_intf_pins axi_interc/M00_AXI]
connect_bd_intf_net [get_bd_intf_pins axis_dacflowctl/s_axis_pd] [get_bd_intf_pins dma_pcie2pd/m_axis_rcv_buf]
connect_bd_intf_net [get_bd_intf_pins dma_pcie2pd/s_axi_csr] [get_bd_intf_pins axi_interc/M01_AXI]
connect_bd_intf_net [get_bd_intf_pins dma_pcie2pd/s_axi_descr] [get_bd_intf_pins axi_interc/M02_AXI]
connect_bd_intf_net [get_bd_intf_pins s_axi_csr] [get_bd_intf_pins axi_interc/S00_AXI]
connect_bd_intf_net [get_bd_intf_pins s_axis_pcie_rc] [get_bd_intf_pins dma_pcie2pd/s_axis_pcie_rc]
connect_bd_intf_net [get_bd_intf_pins m_axis_pcie_rq] [get_bd_intf_pins dma_pcie2pd/m_axis_pcie_rq]
connect_bd_intf_net [get_bd_intf_pins s_axis_pctl] [get_bd_intf_pins axis_dacflowctl/s_axis_pctl]
connect_bd_net [get_bd_pins s_axi_csr_aclk] \
  [get_bd_pins axi_interc/ACLK] [get_bd_pins axi_interc/S00_ACLK] [get_bd_pins axi_interc/M00_ACLK] \
  [get_bd_pins axi_interc/M01_ACLK] [get_bd_pins axi_interc/M02_ACLK] [get_bd_pins axis_dacflowctl/s_axi_csr_aclk] \
  [get_bd_pins dma_pcie2pd/aclk]
connect_bd_net [get_bd_pins s_axi_csr_aresetn] \
  [get_bd_pins axi_interc/ARESETN] [get_bd_pins axi_interc/S00_ARESETN] [get_bd_pins axi_interc/M00_ARESETN] \
  [get_bd_pins axi_interc/M01_ARESETN] [get_bd_pins axi_interc/M02_ARESETN] [get_bd_pins axis_dacflowctl/s_axi_csr_aresetn] \
  [get_bd_pins dma_pcie2pd/aresetn] [get_bd_pins dma_pcie2pd/s_axi_csr_aresetn]
connect_bd_net [get_bd_pins s_axis_pdti_aclk] [get_bd_pins axis_dacflowctl/s_axis_aclk]
connect_bd_net [get_bd_pins s_axis_pdti_aresetn] [get_bd_pins axis_dacflowctl/s_axis_aresetn]
connect_bd_net -net px_dma_pcie2pd_0_irq [get_bd_pins dma_pcie2pd/irq] [get_bd_pins dma_irq]
connect_bd_net [get_bd_pins axis_dacflowctl/irq] [get_bd_pins flowcntl_irq]
connect_bd_net [get_bd_pins axis_dacflowctl/realtime_lost] [get_bd_pins realtime_lost_stat]

current_bd_instance /adc_ch1_acq
connect_bd_intf_net [get_bd_intf_pins s_axi_csr] [get_bd_intf_pins axi_interc/S00_AXI]
connect_bd_intf_net [get_bd_intf_pins pretrig_dly/m_axis_pdti] [get_bd_intf_pins acq_flowcntl/s_axis_pdti]
connect_bd_intf_net [get_bd_intf_pins blk_mem_gen_0/BRAM_PORTA] [get_bd_intf_pins pretrig_dly/bram_wrport]
connect_bd_intf_net [get_bd_intf_pins pretrig_dly/bram_rdport] [get_bd_intf_pins blk_mem_gen_0/BRAM_PORTB]
connect_bd_intf_net [get_bd_intf_pins axi_interc/M00_AXI] [get_bd_intf_pins acq_flowcntl/s_axi_csr]
connect_bd_intf_net [get_bd_intf_pins axi_interc/M02_AXI] [get_bd_intf_pins dma_ppkt2pcie/s_axi_descr]
connect_bd_intf_net [get_bd_intf_pins axi_interc/M01_AXI] [get_bd_intf_pins dma_ppkt2pcie/s_axi_csr]
connect_bd_intf_net [get_bd_intf_pins s_axis_cntl] [get_bd_intf_pins dma_ppkt2pcie/s_axis_cntl]
connect_bd_intf_net [get_bd_intf_pins pretrig_dly/s_axi_csr] [get_bd_intf_pins axi_interc/M03_AXI]
connect_bd_intf_net [get_bd_intf_pins m_axis_pcie_rq] [get_bd_intf_pins dma_ppkt2pcie/m_axis_pcie_rq]
connect_bd_intf_net [get_bd_intf_pins s_axis_pdti] [get_bd_intf_pins pretrig_dly/s_axis_pdti]
connect_bd_intf_net [get_bd_intf_pins dma_ppkt2pcie/s_axis_ppkt] [get_bd_intf_pins acq_flowcntl/m_axis_ppkt]
connect_bd_net [get_bd_pins s_axi_csr_aclk] \
  [get_bd_pins acq_flowcntl/s_axi_csr_aclk] [get_bd_pins axi_interc/ACLK] [get_bd_pins axi_interc/S00_ACLK] \
  [get_bd_pins axi_interc/M00_ACLK] [get_bd_pins axi_interc/M01_ACLK] [get_bd_pins axi_interc/M02_ACLK] \
  [get_bd_pins axi_interc/M03_ACLK] [get_bd_pins dma_ppkt2pcie/aclk] [get_bd_pins pretrig_dly/s_axi_csr_aclk]
connect_bd_net [get_bd_pins s_axi_csr_aresetn] \
  [get_bd_pins acq_flowcntl/s_axi_csr_aresetn] [get_bd_pins axi_interc/ARESETN] [get_bd_pins axi_interc/S00_ARESETN] \
  [get_bd_pins axi_interc/M00_ARESETN] [get_bd_pins axi_interc/M01_ARESETN] [get_bd_pins axi_interc/M02_ARESETN] \
  [get_bd_pins axi_interc/M03_ARESETN] [get_bd_pins dma_ppkt2pcie/aresetn] [get_bd_pins dma_ppkt2pcie/s_axi_csr_aresetn] \
  [get_bd_pins pretrig_dly/s_axi_csr_aresetn]
connect_bd_net [get_bd_pins acq_flowcntl/irq] [get_bd_pins flowcntl_irq]
connect_bd_net [get_bd_pins dma_ppkt2pcie/irq] [get_bd_pins dma_irq]
connect_bd_net [get_bd_pins dma_ppkt2pcie/fifo_full_led] [get_bd_pins fifo_full_stat]
connect_bd_net [get_bd_pins s_axis_pdti_aclk] \
  [get_bd_pins acq_flowcntl/s_axis_aclk] [get_bd_pins dma_ppkt2pcie/s_axis_ppkt_aclk] [get_bd_pins pretrig_dly/s_axis_aclk]
connect_bd_net [get_bd_pins s_axis_pdti_aresetn] \
  [get_bd_pins acq_flowcntl/s_axis_aresetn] [get_bd_pins dma_ppkt2pcie/s_axis_ppkt_aresetn] \
  [get_bd_pins pretrig_dly/s_axis_aresetn]

current_bd_instance /adc_ch2_acq
connect_bd_intf_net [get_bd_intf_pins s_axi_csr] [get_bd_intf_pins axi_interc/S00_AXI]
connect_bd_intf_net [get_bd_intf_pins s_axis_pdti] [get_bd_intf_pins pretrig_dly/s_axis_pdti]
connect_bd_intf_net [get_bd_intf_pins s_axis_cntl] [get_bd_intf_pins dma_ppkt2pcie/s_axis_cntl]
connect_bd_intf_net [get_bd_intf_pins m_axis_pcie_rq] [get_bd_intf_pins dma_ppkt2pcie/m_axis_pcie_rq]
connect_bd_intf_net [get_bd_intf_pins pretrig_dly/s_axi_csr] [get_bd_intf_pins axi_interc/M03_AXI]
connect_bd_intf_net [get_bd_intf_pins blk_mem_gen_0/BRAM_PORTA] [get_bd_intf_pins pretrig_dly/bram_wrport]
connect_bd_intf_net [get_bd_intf_pins pretrig_dly/m_axis_pdti] [get_bd_intf_pins acq_flowcntl/s_axis_pdti]
connect_bd_intf_net [get_bd_intf_pins axi_interc/M00_AXI] [get_bd_intf_pins acq_flowcntl/s_axi_csr]
connect_bd_intf_net [get_bd_intf_pins dma_ppkt2pcie/s_axis_ppkt] [get_bd_intf_pins acq_flowcntl/m_axis_ppkt]
connect_bd_intf_net [get_bd_intf_pins axi_interc/M01_AXI] [get_bd_intf_pins dma_ppkt2pcie/s_axi_csr]
connect_bd_intf_net [get_bd_intf_pins axi_interc/M02_AXI] [get_bd_intf_pins dma_ppkt2pcie/s_axi_descr]
connect_bd_intf_net [get_bd_intf_pins pretrig_dly/bram_rdport] [get_bd_intf_pins blk_mem_gen_0/BRAM_PORTB]
connect_bd_net [get_bd_pins s_axi_csr_aclk] \
  [get_bd_pins acq_flowcntl/s_axi_csr_aclk] [get_bd_pins axi_interc/ACLK] [get_bd_pins axi_interc/S00_ACLK] \
  [get_bd_pins axi_interc/M00_ACLK] [get_bd_pins axi_interc/M01_ACLK] [get_bd_pins axi_interc/M02_ACLK] \
  [get_bd_pins axi_interc/M03_ACLK] [get_bd_pins dma_ppkt2pcie/aclk] [get_bd_pins pretrig_dly/s_axi_csr_aclk]
connect_bd_net [get_bd_pins s_axi_csr_aresetn] \
  [get_bd_pins acq_flowcntl/s_axi_csr_aresetn] [get_bd_pins axi_interc/ARESETN] [get_bd_pins axi_interc/S00_ARESETN] \
  [get_bd_pins axi_interc/M00_ARESETN] [get_bd_pins axi_interc/M01_ARESETN] [get_bd_pins axi_interc/M02_ARESETN] \
  [get_bd_pins axi_interc/M03_ARESETN] [get_bd_pins dma_ppkt2pcie/aresetn] [get_bd_pins dma_ppkt2pcie/s_axi_csr_aresetn] \
  [get_bd_pins pretrig_dly/s_axi_csr_aresetn]
connect_bd_net [get_bd_pins acq_flowcntl/irq] [get_bd_pins flowcntl_irq]
connect_bd_net [get_bd_pins dma_ppkt2pcie/irq] [get_bd_pins dma_irq]
connect_bd_net [get_bd_pins dma_ppkt2pcie/fifo_full_led] [get_bd_pins fifo_full_stat]
connect_bd_net [get_bd_pins s_axis_pdti_aclk] \
  [get_bd_pins acq_flowcntl/s_axis_aclk] [get_bd_pins dma_ppkt2pcie/s_axis_ppkt_aclk] [get_bd_pins pretrig_dly/s_axis_aclk]
connect_bd_net [get_bd_pins s_axis_pdti_aresetn] \
  [get_bd_pins acq_flowcntl/s_axis_aresetn] [get_bd_pins dma_ppkt2pcie/s_axis_ppkt_aresetn] \
  [get_bd_pins pretrig_dly/s_axis_aresetn]

current_bd_instance /
connect_bd_intf_net [get_bd_intf_ports s_axis_wave_ddr_rsp] [get_bd_intf_pins dac_ddr2wave/s_axis_ddr_rsp]
connect_bd_intf_net [get_bd_intf_ports m_axis_dac_pdti] [get_bd_intf_pins dac_out_mux/m_axis_pdti]
connect_bd_intf_net [get_bd_intf_ports s_axis_dac_pctl] [get_bd_intf_pins ctl_broadcast/S_AXIS]
connect_bd_intf_net [get_bd_intf_ports s_axis_pcie_rc] [get_bd_intf_pins rc_broadcast/S_AXIS]
connect_bd_intf_net [get_bd_intf_pins adc_ch2_acq/m_axis_pcie_rq] [get_bd_intf_pins rq_regslice_2/S_AXIS]
connect_bd_intf_net [get_bd_intf_pins axi_interct1/M00_AXI] [get_bd_intf_pins dac_ch0_acq/s_axi_csr]
connect_bd_intf_net [get_bd_intf_pins ctl_broadcast/M00_AXIS] [get_bd_intf_pins dac_ch0_acq/s_axis_pctl]
connect_bd_intf_net [get_bd_intf_pins rq_arb/S02_AXIS] [get_bd_intf_pins rq_regslice_2/M_AXIS]
connect_bd_intf_net [get_bd_intf_pins rq_arb/S04_AXIS] [get_bd_intf_pins rq_regslice_6/M_AXIS]
connect_bd_intf_net [get_bd_intf_pins dac_ch1_acq/m_axis_pcie_rq] [get_bd_intf_pins rq_regslice_6/S_AXIS]
connect_bd_intf_net [get_bd_intf_pins axi_interct0/M05_AXI] [get_bd_intf_pins dac_out_mux/s_axi_csr]
connect_bd_intf_net [get_bd_intf_pins dac_ch0_acq/m_axis_pcie_rq] [get_bd_intf_pins rq_regslice_3/S_AXIS]
connect_bd_intf_net [get_bd_intf_pins pcie_cntl_broadcast/M00_AXIS] [get_bd_intf_pins adc_ch0_acq/s_axis_cntl]
connect_bd_intf_net [get_bd_intf_pins adc_ch0_acq/m_axis_pcie_rq] [get_bd_intf_pins rq_regslice_0/S_AXIS]
connect_bd_intf_net [get_bd_intf_pins axi_interct0/M02_AXI] [get_bd_intf_pins adc_ch2_acq/s_axi_csr]
connect_bd_intf_net [get_bd_intf_pins ch1_broadcast/M01_AXIS] [get_bd_intf_pins dac_out_mux/s_axis_i2_pdti]
connect_bd_intf_net [get_bd_intf_pins rq_regslice_1/M_AXIS] [get_bd_intf_pins rq_arb/S01_AXIS]
connect_bd_intf_net [get_bd_intf_pins axi_interct1/M01_AXI] [get_bd_intf_pins dac_ch1_acq/s_axi_csr]
connect_bd_intf_net [get_bd_intf_pins ch1_broadcast/S_AXIS] [get_bd_intf_pins dac_ch1_acq/m_axis_pdti]
connect_bd_intf_net [get_bd_intf_pins subset_combine/M_AXIS] [get_bd_intf_pins dac_out_mux/s_axis_i1_pdti]
connect_bd_intf_net [get_bd_intf_pins ch0_broadcast/M00_AXIS] [get_bd_intf_pins dac_out_mux/s_axis_i0_pdti]
connect_bd_intf_net [get_bd_intf_pins rq_arb/M00_AXIS] [get_bd_intf_pins rq_regslice_4/S_AXIS]
connect_bd_intf_net [get_bd_intf_pins axi_interct0/M00_AXI] [get_bd_intf_pins adc_ch0_acq/s_axi_csr]
connect_bd_intf_net [get_bd_intf_pins rsp_regslice2/M_AXIS] [get_bd_intf_pins dma_pcie2ddr/s_axis_pcie_rc]
connect_bd_intf_net [get_bd_intf_pins rc_broadcast/M02_AXIS] [get_bd_intf_pins rsp_regslice2/S_AXIS]
connect_bd_intf_net [get_bd_intf_pins ch0_subset/M_AXIS] [get_bd_intf_pins subset_combine/S00_AXIS]
connect_bd_intf_net [get_bd_intf_pins axi_interct1/M02_AXI] [get_bd_intf_pins dac_ddr2wave/s_axi_csr]
connect_bd_intf_net [get_bd_intf_pins dac_ddr2wave/m_axis_pdti] [get_bd_intf_pins dac_out_mux/s_axis_i3_pdti]
connect_bd_intf_net [get_bd_intf_pins adc_ch1_acq/m_axis_pcie_rq] [get_bd_intf_pins rq_regslice_1/S_AXIS]
connect_bd_intf_net [get_bd_intf_pins dac_ch1_acq/s_axis_cntl] [get_bd_intf_pins pcie_cntl_broadcast/M04_AXIS]
connect_bd_intf_net [get_bd_intf_pins ch1_subset/M_AXIS] [get_bd_intf_pins subset_combine/S01_AXIS]
connect_bd_intf_net [get_bd_intf_pins dac_ddr2wave/s_axis_pctl] [get_bd_intf_pins ctl_broadcast/M02_AXIS]
connect_bd_intf_net [get_bd_intf_ports s_axi_csr] [get_bd_intf_pins axi_interct0/S00_AXI]
connect_bd_intf_net [get_bd_intf_pins rq_regslice_0/M_AXIS] [get_bd_intf_pins rq_arb/S00_AXIS]
connect_bd_intf_net [get_bd_intf_pins axi_interct1/M03_AXI] [get_bd_intf_pins dma_pcie2ddr/s_axi_csr]
connect_bd_intf_net [get_bd_intf_pins axi_interct0/M01_AXI] [get_bd_intf_pins adc_ch1_acq/s_axi_csr]
connect_bd_intf_net [get_bd_intf_pins ch1_broadcast/M00_AXIS] [get_bd_intf_pins ch1_subset/S_AXIS]
connect_bd_intf_net [get_bd_intf_pins pcie_cntl_broadcast/M02_AXIS] [get_bd_intf_pins adc_ch2_acq/s_axis_cntl]
connect_bd_intf_net [get_bd_intf_pins rc_broadcast/M00_AXIS] [get_bd_intf_pins rsp_regslice0/S_AXIS]
connect_bd_intf_net [get_bd_intf_ports s_axis_adc_ch0_pdti] [get_bd_intf_pins adc_ch0_acq/s_axis_pdti]
connect_bd_intf_net [get_bd_intf_ports s_axis_adc_ch1_pdti] [get_bd_intf_pins adc_ch1_acq/s_axis_pdti]
connect_bd_intf_net [get_bd_intf_pins rsp_regslice0/M_AXIS] [get_bd_intf_pins dac_ch0_acq/s_axis_pcie_rc]
connect_bd_intf_net [get_bd_intf_pins rc_broadcast/M01_AXIS] [get_bd_intf_pins rsp_regslice1/S_AXIS]
connect_bd_intf_net [get_bd_intf_pins dac_ch0_acq/s_axis_cntl] [get_bd_intf_pins pcie_cntl_broadcast/M03_AXIS]
connect_bd_intf_net [get_bd_intf_ports m_axis_pcie_rq] [get_bd_intf_pins rq_regslice_5/M_AXIS]
connect_bd_intf_net [get_bd_intf_pins axi_interct0/M04_AXI] [get_bd_intf_pins px_irq_pls_aggr_0/s_axi_csr]
connect_bd_intf_net [get_bd_intf_pins ch0_broadcast/S_AXIS] [get_bd_intf_pins dac_ch0_acq/m_axis_pdti]
connect_bd_intf_net [get_bd_intf_pins dma_pcie2ddr/m_axis_rqst] [get_bd_intf_pins ddr_rqst_arb/S01_AXIS]
connect_bd_intf_net [get_bd_intf_pins ch0_broadcast/M01_AXIS] [get_bd_intf_pins ch0_subset/S_AXIS]
connect_bd_intf_net [get_bd_intf_pins ctl_broadcast/M01_AXIS] [get_bd_intf_pins dac_ch1_acq/s_axis_pctl]
connect_bd_intf_net [get_bd_intf_pins dma_pcie2ddr/m_axis_pcie_rq] [get_bd_intf_pins rq_arb/S05_AXIS]
connect_bd_intf_net [get_bd_intf_pins dac_ddr2wave/m_axis_ddr_rqst] [get_bd_intf_pins ddr_rqst_arb/S00_AXIS]
connect_bd_intf_net [get_bd_intf_pins rsp_regslice1/M_AXIS] [get_bd_intf_pins dac_ch1_acq/s_axis_pcie_rc]
connect_bd_intf_net [get_bd_intf_ports s_axis_dma_pcie_cntl] [get_bd_intf_pins pcie_cntl_broadcast/S_AXIS]
connect_bd_intf_net [get_bd_intf_pins pcie_cntl_broadcast/M01_AXIS] [get_bd_intf_pins adc_ch1_acq/s_axis_cntl]
connect_bd_intf_net [get_bd_intf_pins rq_arb/S03_AXIS] [get_bd_intf_pins rq_regslice_3/M_AXIS]
connect_bd_intf_net [get_bd_intf_pins axi_interct1/S00_AXI] [get_bd_intf_pins axi_interct0/M03_AXI]
connect_bd_intf_net [get_bd_intf_pins dma_pcie2ddr/s_axis_cntl] [get_bd_intf_pins pcie_cntl_broadcast/M05_AXIS]
connect_bd_intf_net [get_bd_intf_pins rq_regslice_4/M_AXIS] [get_bd_intf_pins rq_regslice_5/S_AXIS]
connect_bd_intf_net [get_bd_intf_ports m_axis_ddr_rqst] [get_bd_intf_pins ddr_rqst_arb/M00_AXIS]
connect_bd_intf_net [get_bd_intf_ports s_axis_adc_ch2_pdti] [get_bd_intf_pins adc_ch2_acq/s_axis_pdti]
connect_bd_net -net ACLK_1 [get_bd_ports s_axi_csr_aclk] \
  [get_bd_pins adc_ch0_acq/s_axi_csr_aclk] [get_bd_pins dac_ch1_acq/s_axi_csr_aclk] [get_bd_pins dac_ch0_acq/s_axi_csr_aclk] \
  [get_bd_pins adc_ch1_acq/s_axi_csr_aclk] [get_bd_pins adc_ch2_acq/s_axi_csr_aclk] [get_bd_pins axi_interct0/ACLK] \
  [get_bd_pins axi_interct0/S00_ACLK] [get_bd_pins axi_interct0/M00_ACLK] [get_bd_pins axi_interct0/M01_ACLK] \
  [get_bd_pins axi_interct0/M02_ACLK] [get_bd_pins axi_interct0/M03_ACLK] [get_bd_pins axi_interct0/M04_ACLK] \
  [get_bd_pins axi_interct0/M05_ACLK] [get_bd_pins axi_interct1/ACLK] [get_bd_pins axi_interct1/S00_ACLK] \
  [get_bd_pins axi_interct1/M00_ACLK] [get_bd_pins axi_interct1/M01_ACLK] [get_bd_pins axi_interct1/M02_ACLK] \
  [get_bd_pins axi_interct1/M03_ACLK] [get_bd_pins pcie_cntl_broadcast/aclk] [get_bd_pins rq_regslice_0/aclk] \
  [get_bd_pins rq_arb/aclk] [get_bd_pins rc_broadcast/aclk] [get_bd_pins dac_ddr2wave/s_axi_csr_aclk] \
  [get_bd_pins dac_out_mux/s_axi_csr_aclk] [get_bd_pins dma_pcie2ddr/aclk] [get_bd_pins px_irq_pls_aggr_0/s_axi_csr_aclk] \
  [get_bd_pins rq_regslice_1/aclk] [get_bd_pins rq_regslice_4/aclk] [get_bd_pins rq_regslice_2/aclk] \
  [get_bd_pins rq_regslice_3/aclk] [get_bd_pins rsp_regslice0/aclk] [get_bd_pins rq_regslice_6/aclk] \
  [get_bd_pins rq_regslice_5/aclk] [get_bd_pins rsp_regslice1/aclk] [get_bd_pins rsp_regslice2/aclk]
connect_bd_net [get_bd_ports s_axi_csr_aresetn] \
  [get_bd_pins adc_ch0_acq/s_axi_csr_aresetn] [get_bd_pins dac_ch1_acq/s_axi_csr_aresetn] \
  [get_bd_pins dac_ch0_acq/s_axi_csr_aresetn] [get_bd_pins adc_ch1_acq/s_axi_csr_aresetn] \
  [get_bd_pins adc_ch2_acq/s_axi_csr_aresetn] [get_bd_pins axi_interct0/ARESETN] [get_bd_pins axi_interct0/S00_ARESETN] \
  [get_bd_pins axi_interct0/M00_ARESETN] [get_bd_pins axi_interct0/M01_ARESETN] [get_bd_pins axi_interct0/M02_ARESETN] \
  [get_bd_pins axi_interct0/M03_ARESETN] [get_bd_pins axi_interct0/M04_ARESETN] [get_bd_pins axi_interct0/M05_ARESETN] \
  [get_bd_pins axi_interct1/ARESETN] [get_bd_pins axi_interct1/S00_ARESETN] [get_bd_pins axi_interct1/M00_ARESETN] \
  [get_bd_pins axi_interct1/M01_ARESETN] [get_bd_pins axi_interct1/M02_ARESETN] [get_bd_pins axi_interct1/M03_ARESETN] \
  [get_bd_pins pcie_cntl_broadcast/aresetn] [get_bd_pins rq_regslice_0/aresetn] [get_bd_pins rq_arb/aresetn] \
  [get_bd_pins rc_broadcast/aresetn] [get_bd_pins dac_ddr2wave/s_axi_csr_aresetn] [get_bd_pins dac_out_mux/s_axi_csr_aresetn] \
  [get_bd_pins dma_pcie2ddr/aresetn] [get_bd_pins dma_pcie2ddr/s_axi_csr_aresetn] \
  [get_bd_pins px_irq_pls_aggr_0/s_axi_csr_aresetn] [get_bd_pins cdc_async_rst/src_arst] [get_bd_pins rq_regslice_1/aresetn] \
  [get_bd_pins rq_regslice_4/aresetn] [get_bd_pins rq_regslice_2/aresetn] [get_bd_pins rq_regslice_3/aresetn] \
  [get_bd_pins rsp_regslice0/aresetn] [get_bd_pins rq_regslice_6/aresetn] [get_bd_pins rq_regslice_5/aresetn] \
  [get_bd_pins rsp_regslice1/aresetn] [get_bd_pins rsp_regslice2/aresetn]
connect_bd_net [get_bd_ports s_axis_adc_pdti_aclk] \
  [get_bd_pins adc_ch0_acq/s_axis_pdti_aclk] [get_bd_pins adc_ch1_acq/s_axis_pdti_aclk] \
  [get_bd_pins adc_ch2_acq/s_axis_pdti_aclk]
connect_bd_net [get_bd_ports s_axis_adc_pdti_aresetn] \
  [get_bd_pins adc_ch0_acq/s_axis_pdti_aresetn] [get_bd_pins adc_ch1_acq/s_axis_pdti_aresetn] \
  [get_bd_pins adc_ch2_acq/s_axis_pdti_aresetn]
connect_bd_net [get_bd_ports shutdown_rqst] \
  [get_bd_ports rq_shutdown_ok] [get_bd_pins shutdown_vctr/input0] [get_bd_pins shutdown_vctr/input1] \
  [get_bd_pins shutdown_vctr/input2] [get_bd_pins shutdown_vctr/input3] [get_bd_pins shutdown_vctr/input4] \
  [get_bd_pins shutdown_vctr/input5]
connect_bd_net -net px_scalar2vctr_0_output_vector [get_bd_pins shutdown_vctr/output_vector] [get_bd_pins rq_arb/s_req_suppress]
connect_bd_net -net ch0_adc_acq_dma_irq [get_bd_pins adc_ch0_acq/dma_irq] [get_bd_pins dma_irq_vctr/input0]
connect_bd_net [get_bd_pins dma_irq_vctr/output_vector] [get_bd_pins irq_concat/In0]
connect_bd_net -net xlconstant_0_dout [get_bd_pins empty_irq/dout] [get_bd_pins irq_concat/In1]
connect_bd_net [get_bd_pins irq_concat/dout] [get_bd_ports pcie_dma_irq]
connect_bd_net -net ch0_adc_acq_fifo_full_stat [get_bd_pins adc_ch0_acq/fifo_full_stat] [get_bd_ports adc0_fifo_full_stat]
connect_bd_net -net ch0_adc_acq_flowcntl_irq [get_bd_pins adc_ch0_acq/flowcntl_irq] [get_bd_pins flowcntl_irqvctr/input0]
connect_bd_net [get_bd_pins flowcntl_irqvctr/output_vector] [get_bd_pins px_irq_pls_aggr_0/intrpt_in]
connect_bd_net [get_bd_pins px_irq_pls_aggr_0/irq_out] [get_bd_ports pdti2ppkt_irq]
connect_bd_net -net util_reduced_logic_0_Res [get_bd_pins rtlost_or/Res] [get_bd_ports realtime_lost_stat]
connect_bd_net -net px_scalar2vctr_0_output_vector1 [get_bd_pins rtlost_s2v/output_vector] [get_bd_pins rtlost_or/Op1]
connect_bd_net -net dac_ch0_acq1_realtime_lost_stat [get_bd_pins dac_ch1_acq/realtime_lost_stat] [get_bd_pins rtlost_s2v/input1]
connect_bd_net -net dac_ch0_acq1_flowcntl_irq [get_bd_pins dac_ch1_acq/flowcntl_irq] [get_bd_pins flowcntl_irqvctr/input5]
connect_bd_net [get_bd_pins zero/dout] \
  [get_bd_pins flowcntl_irqvctr/input3] [get_bd_pins flowcntl_irqvctr/input6] [get_bd_pins flowcntl_irqvctr/input7] \
  [get_bd_pins dma_irq_vctr/input3] [get_bd_pins dma_irq_vctr/input6] [get_bd_pins dma_irq_vctr/input7]
connect_bd_net -net dac_ch0_acq1_dma_irq [get_bd_pins dac_ch1_acq/dma_irq] [get_bd_pins dma_irq_vctr/input5]
connect_bd_net [get_bd_ports s_axis_dac_pdti_aclk] \
  [get_bd_pins dac_ch1_acq/s_axis_pdti_aclk] [get_bd_pins dac_ch0_acq/s_axis_pdti_aclk] [get_bd_pins ctl_broadcast/aclk] \
  [get_bd_pins ch0_broadcast/aclk] [get_bd_pins subset_combine/aclk] [get_bd_pins ch0_subset/aclk] \
  [get_bd_pins ch1_subset/aclk] [get_bd_pins ch1_broadcast/aclk] [get_bd_pins dac_ddr2wave/s_axis_aclk] \
  [get_bd_pins dac_out_mux/s_axis_aclk]
connect_bd_net [get_bd_ports s_axis_dac_pdti_aresetn] \
  [get_bd_pins dac_ch1_acq/s_axis_pdti_aresetn] [get_bd_pins dac_ch0_acq/s_axis_pdti_aresetn] \
  [get_bd_pins ctl_broadcast/aresetn] [get_bd_pins ch0_broadcast/aresetn] [get_bd_pins subset_combine/aresetn] \
  [get_bd_pins ch0_subset/aresetn] [get_bd_pins ch1_subset/aresetn] [get_bd_pins ch1_broadcast/aresetn] \
  [get_bd_pins dac_ddr2wave/s_axis_aresetn] [get_bd_pins dac_out_mux/s_axis_aresetn]
connect_bd_net [get_bd_pins dac_ddr2wave/irq] [get_bd_pins flowcntl_irqvctr/input8]
connect_bd_net [get_bd_pins dac_ddr2wave/realtime_lost] [get_bd_pins rtlost_s2v/input2]
connect_bd_net [get_bd_pins dac_ch0_acq/realtime_lost_stat] [get_bd_pins rtlost_s2v/input0]
connect_bd_net [get_bd_pins dac_ch0_acq/dma_irq] [get_bd_pins dma_irq_vctr/input4]
connect_bd_net [get_bd_pins dac_ch0_acq/flowcntl_irq] [get_bd_pins flowcntl_irqvctr/input4]
connect_bd_net [get_bd_pins adc_ch1_acq/flowcntl_irq] [get_bd_pins flowcntl_irqvctr/input1]
connect_bd_net [get_bd_pins adc_ch2_acq/flowcntl_irq] [get_bd_pins flowcntl_irqvctr/input2]
connect_bd_net [get_bd_pins adc_ch1_acq/dma_irq] [get_bd_pins dma_irq_vctr/input1]
connect_bd_net [get_bd_pins adc_ch2_acq/dma_irq] [get_bd_pins dma_irq_vctr/input2]
connect_bd_net [get_bd_pins adc_ch1_acq/fifo_full_stat] [get_bd_ports adc1_fifo_full_stat]
connect_bd_net [get_bd_pins adc_ch2_acq/fifo_full_stat] [get_bd_ports adc2_fifo_full_stat]
connect_bd_net [get_bd_pins const0/dout] [get_bd_pins ddr_rqst_arb/s_req_suppress]
connect_bd_net [get_bd_ports ddr4_ui_clk] \
  [get_bd_pins dac_ddr2wave/m_axis_ddr_aclk] [get_bd_pins dma_pcie2ddr/axis_ddr_aclk] [get_bd_pins cdc_async_rst/dest_clk] \
  [get_bd_pins ddr_rqst_arb/aclk]
connect_bd_net [get_bd_pins cdc_async_rst/dest_arst] [get_bd_pins ddr_rqst_arb/aresetn]
connect_bd_net [get_bd_pins dma_pcie2ddr/irq] [get_bd_pins dma_irq_vctr/input8]
